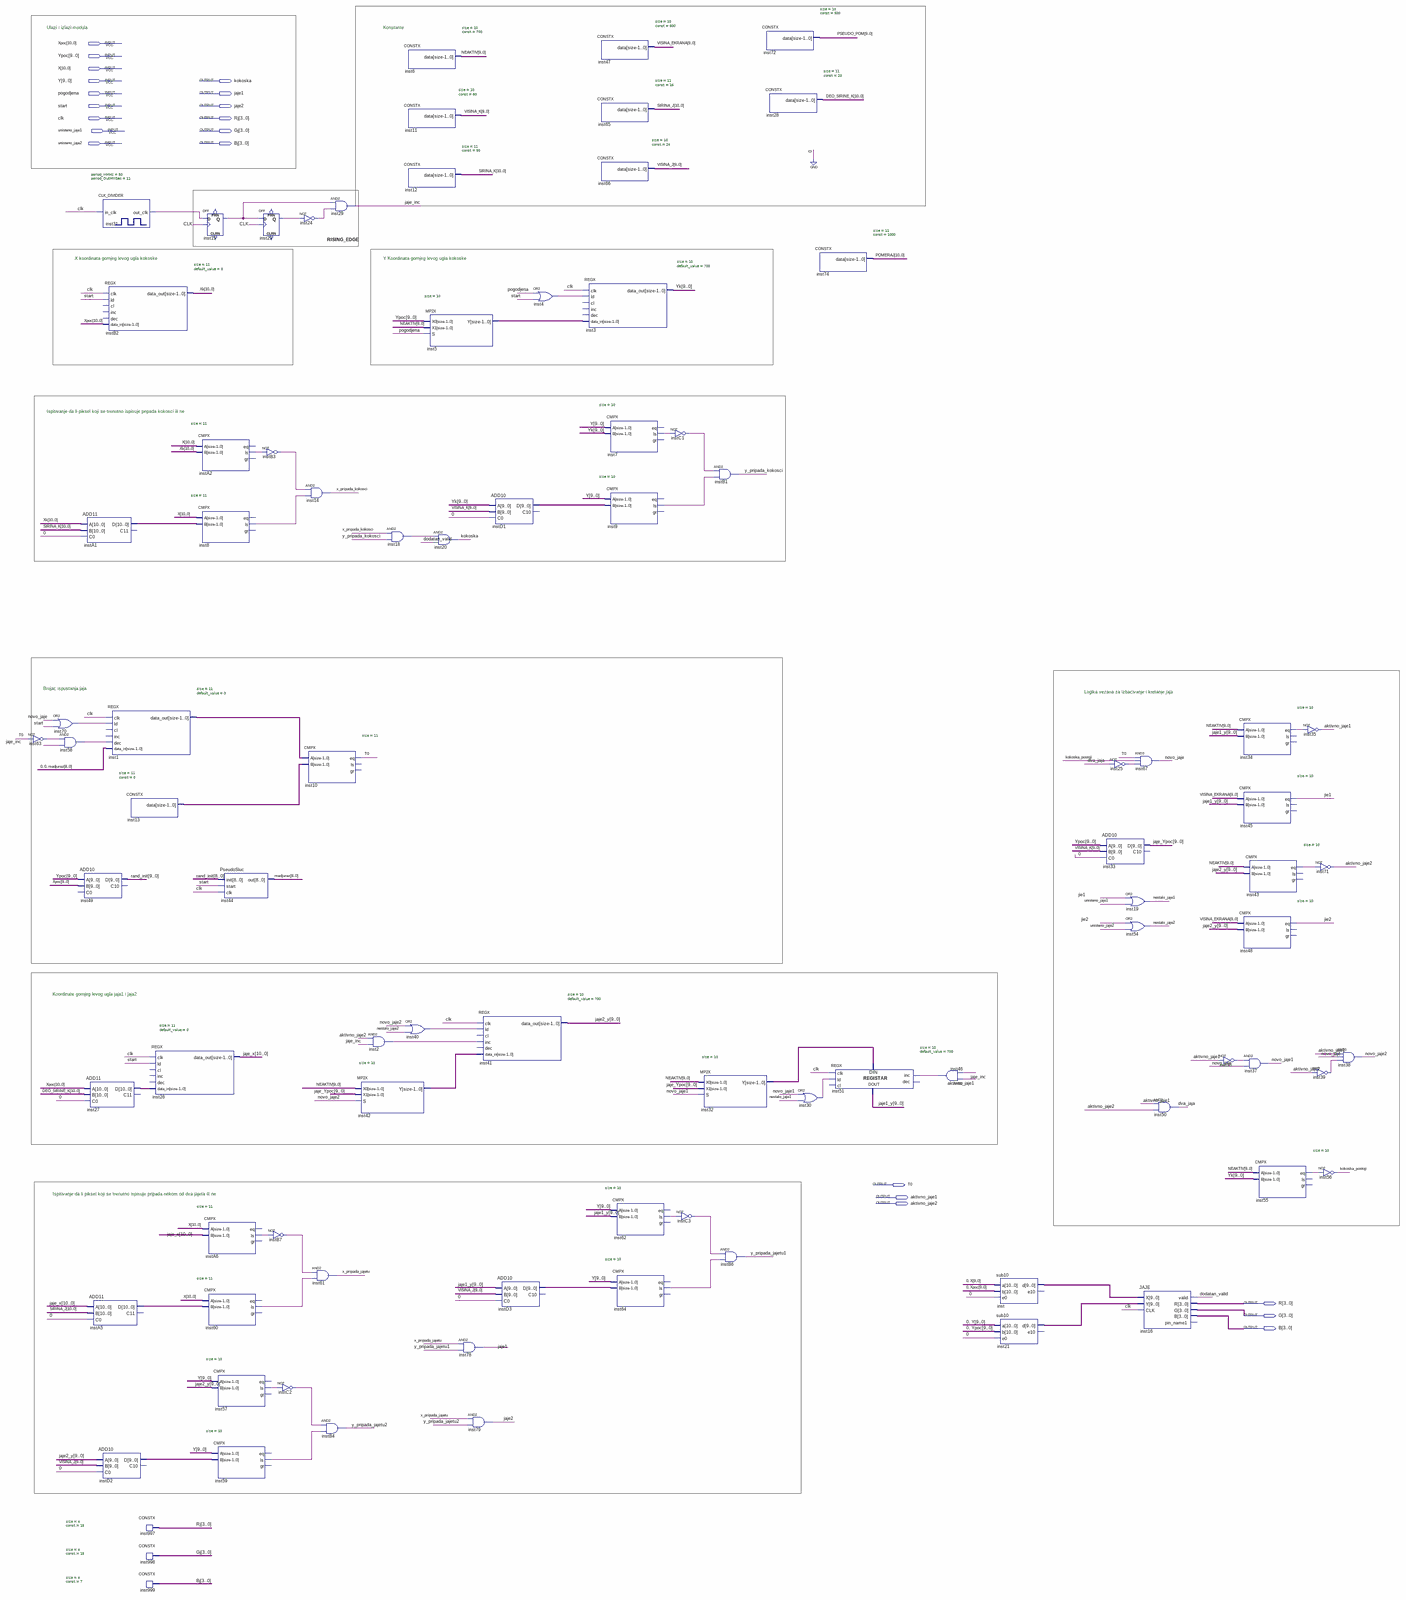
[diagram p0: schematic sheet, whole]
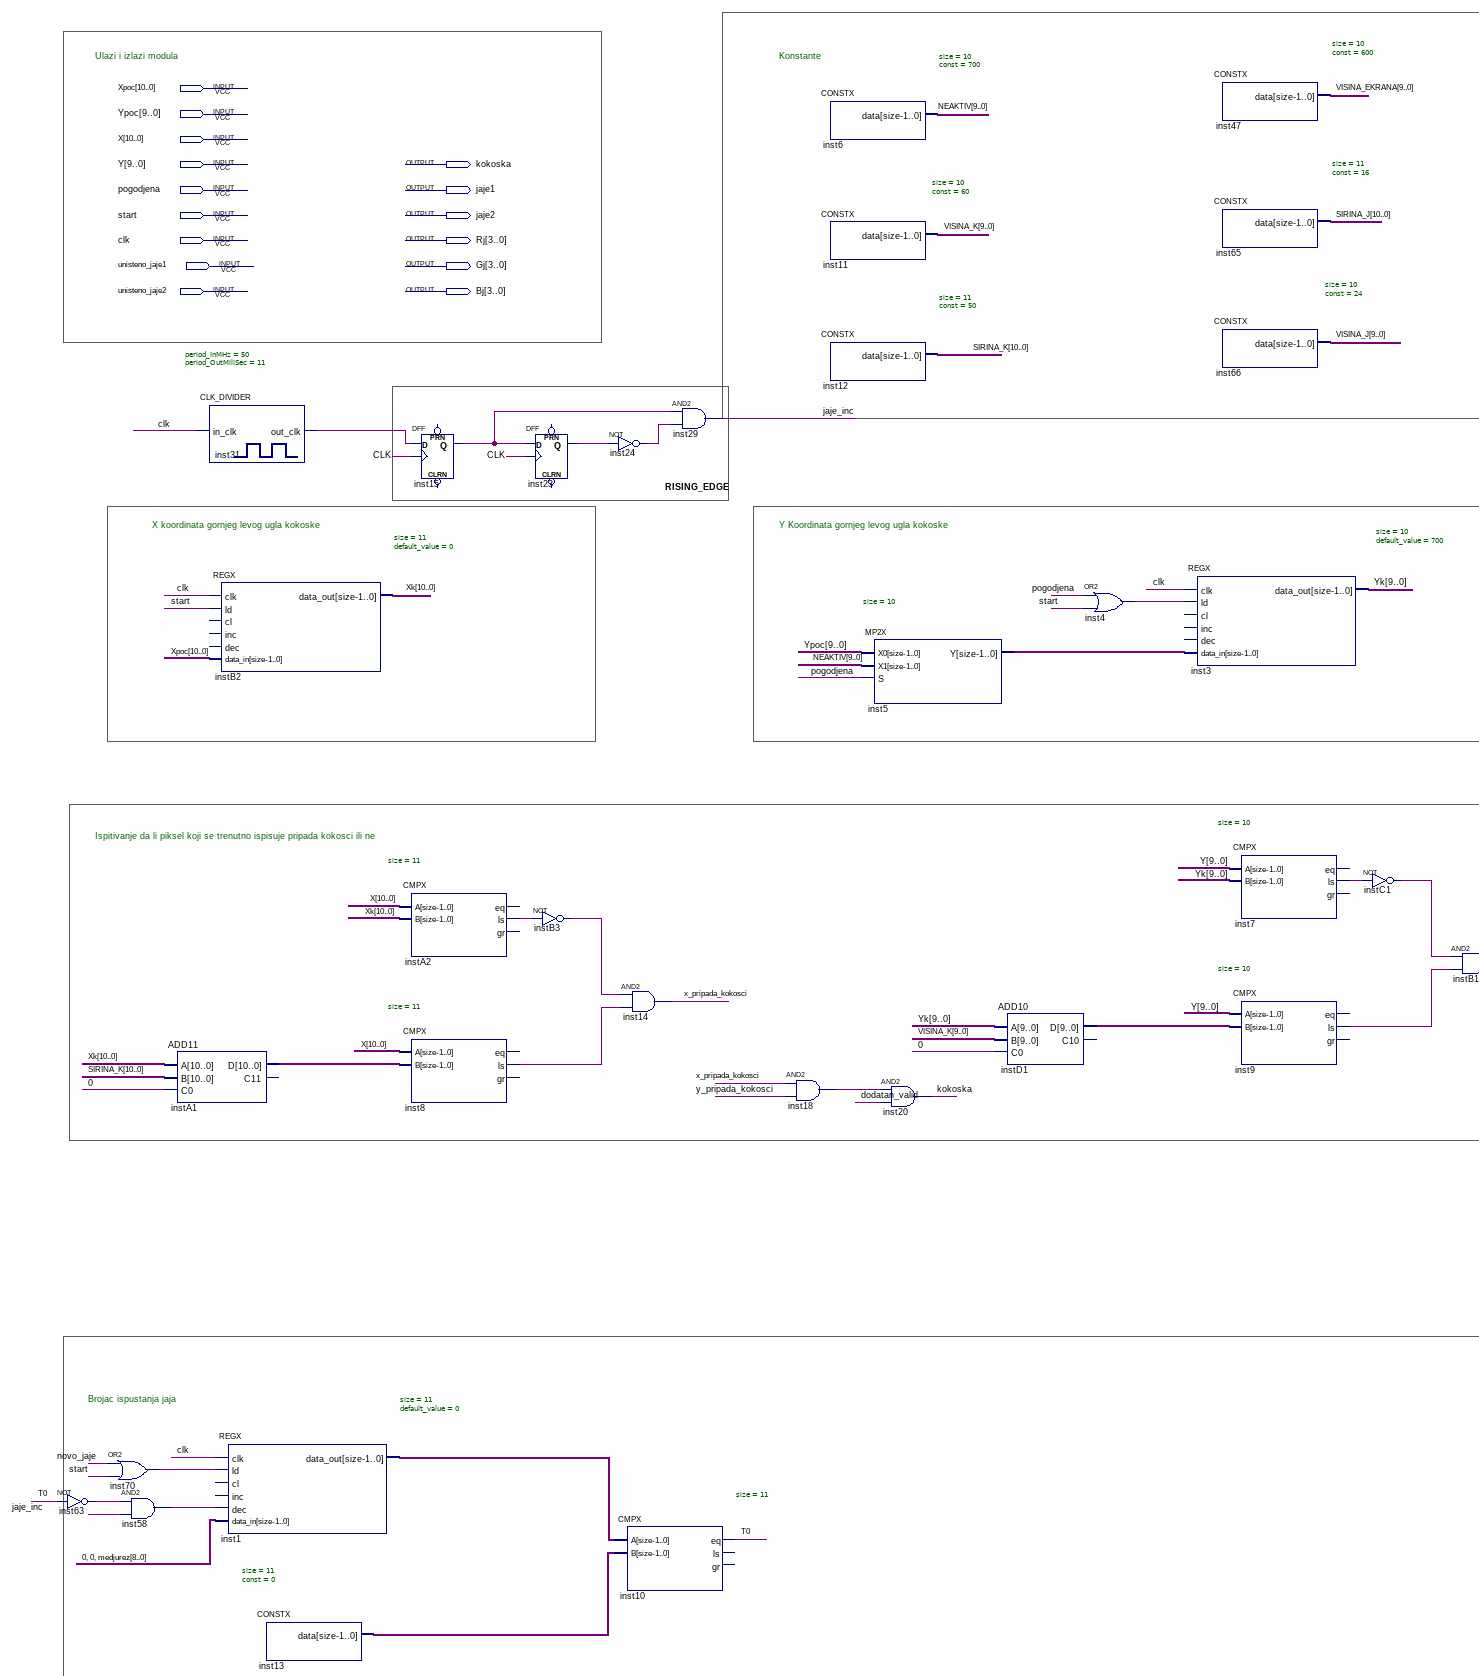
[diagram p1: schematic sheet, upper left part]
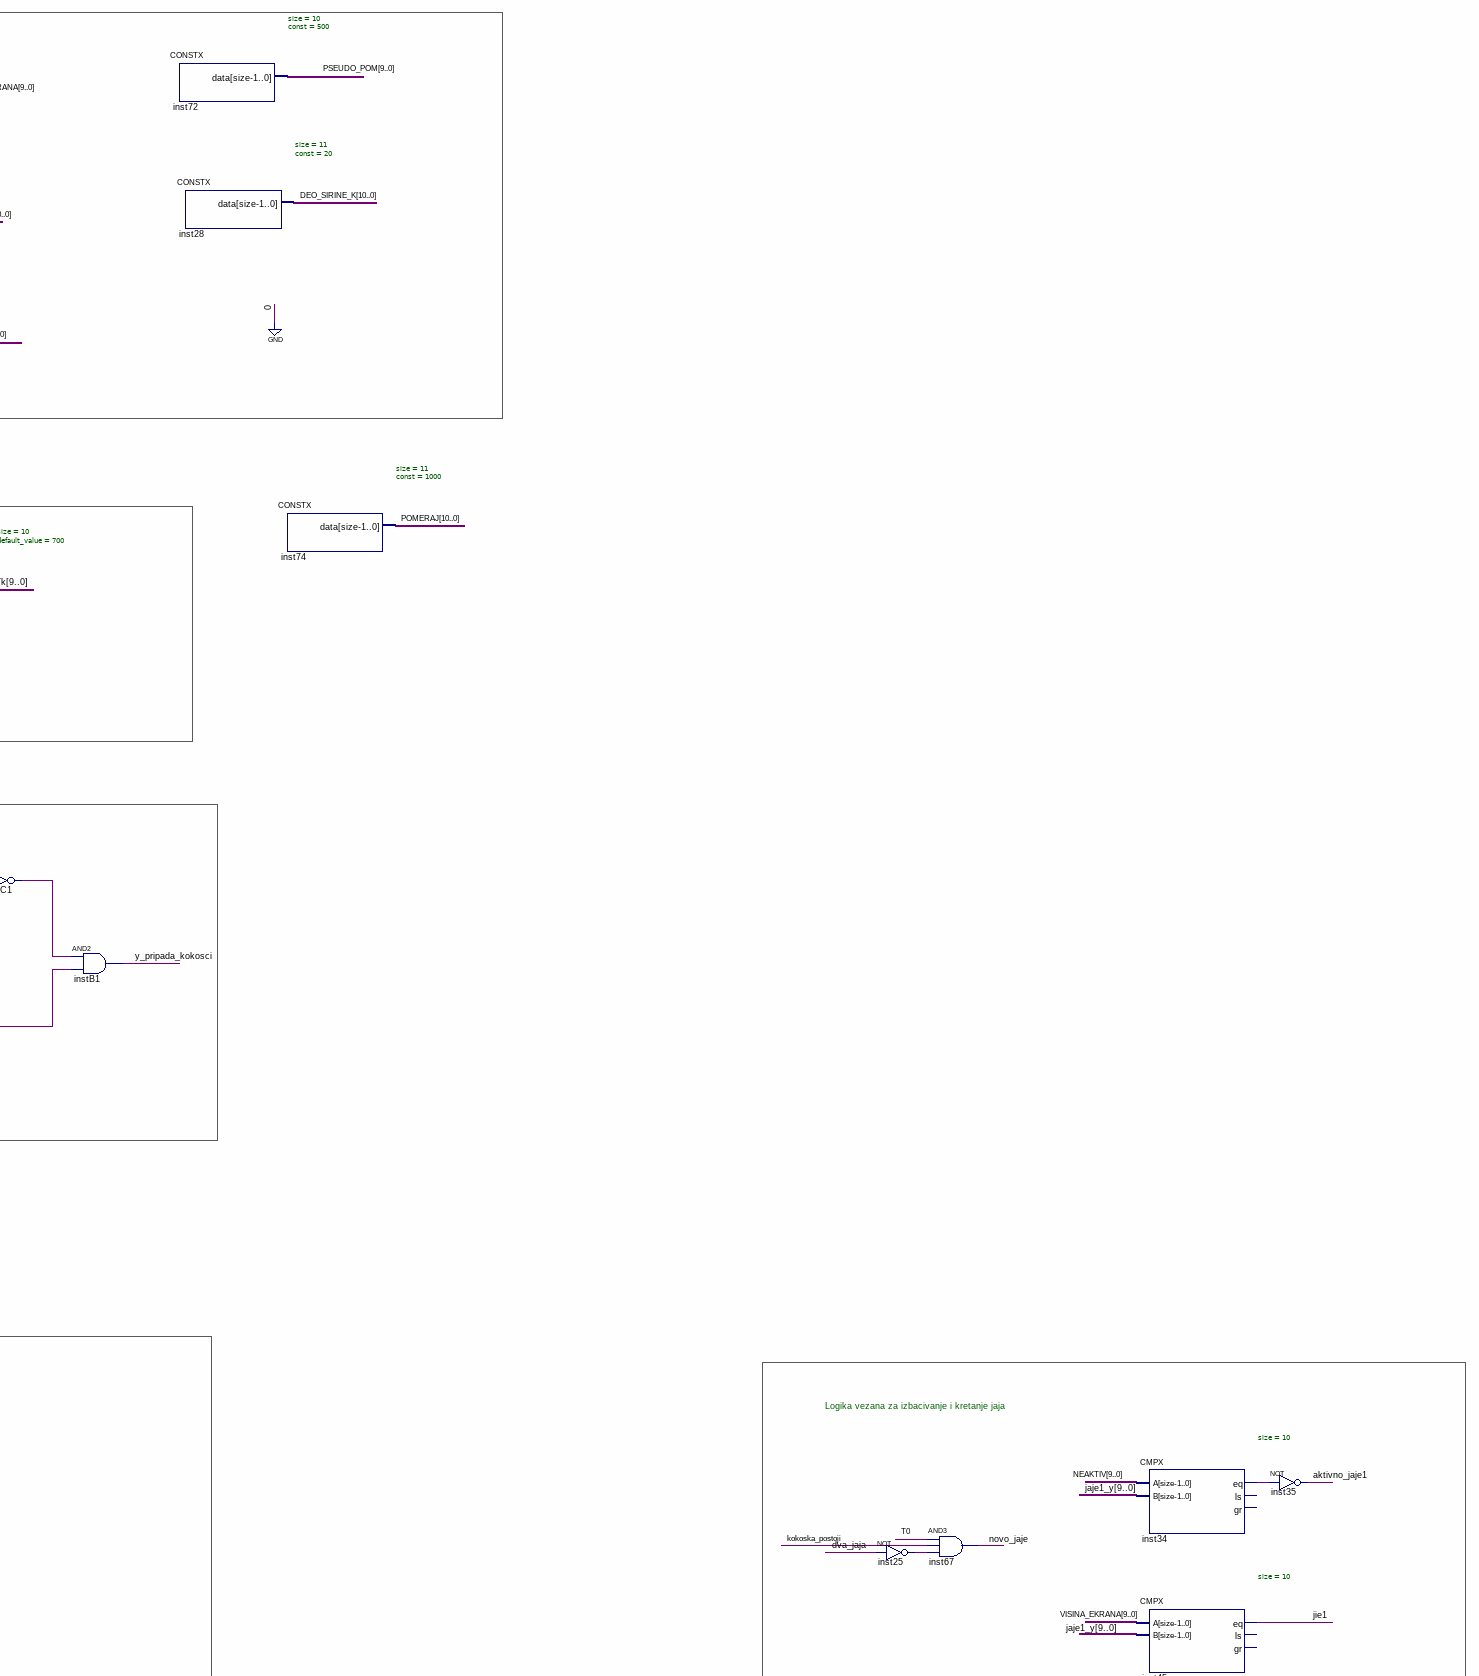
[diagram p2: schematic sheet, upper right part]
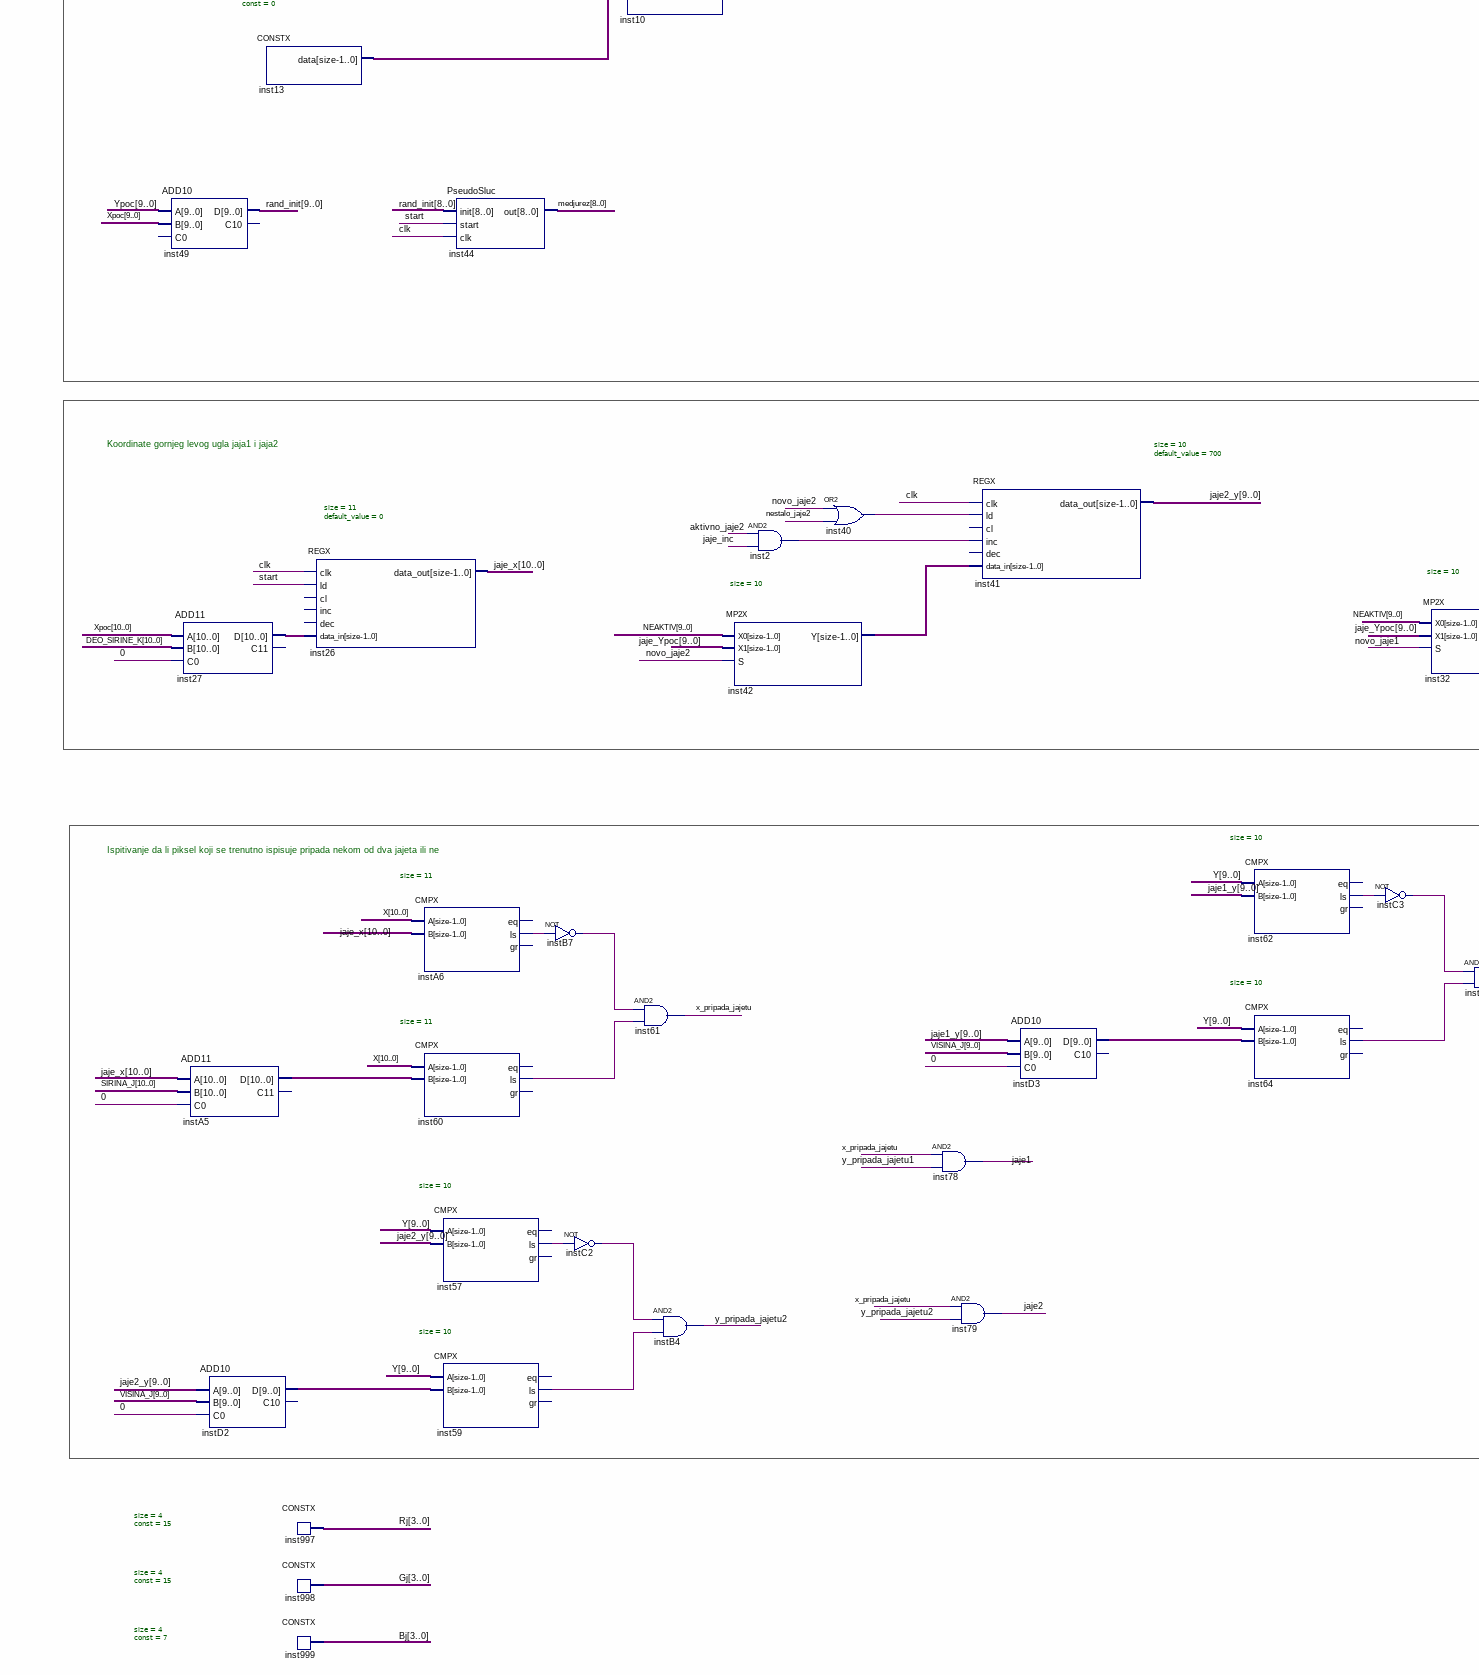
[diagram p3: schematic sheet, lower left part]
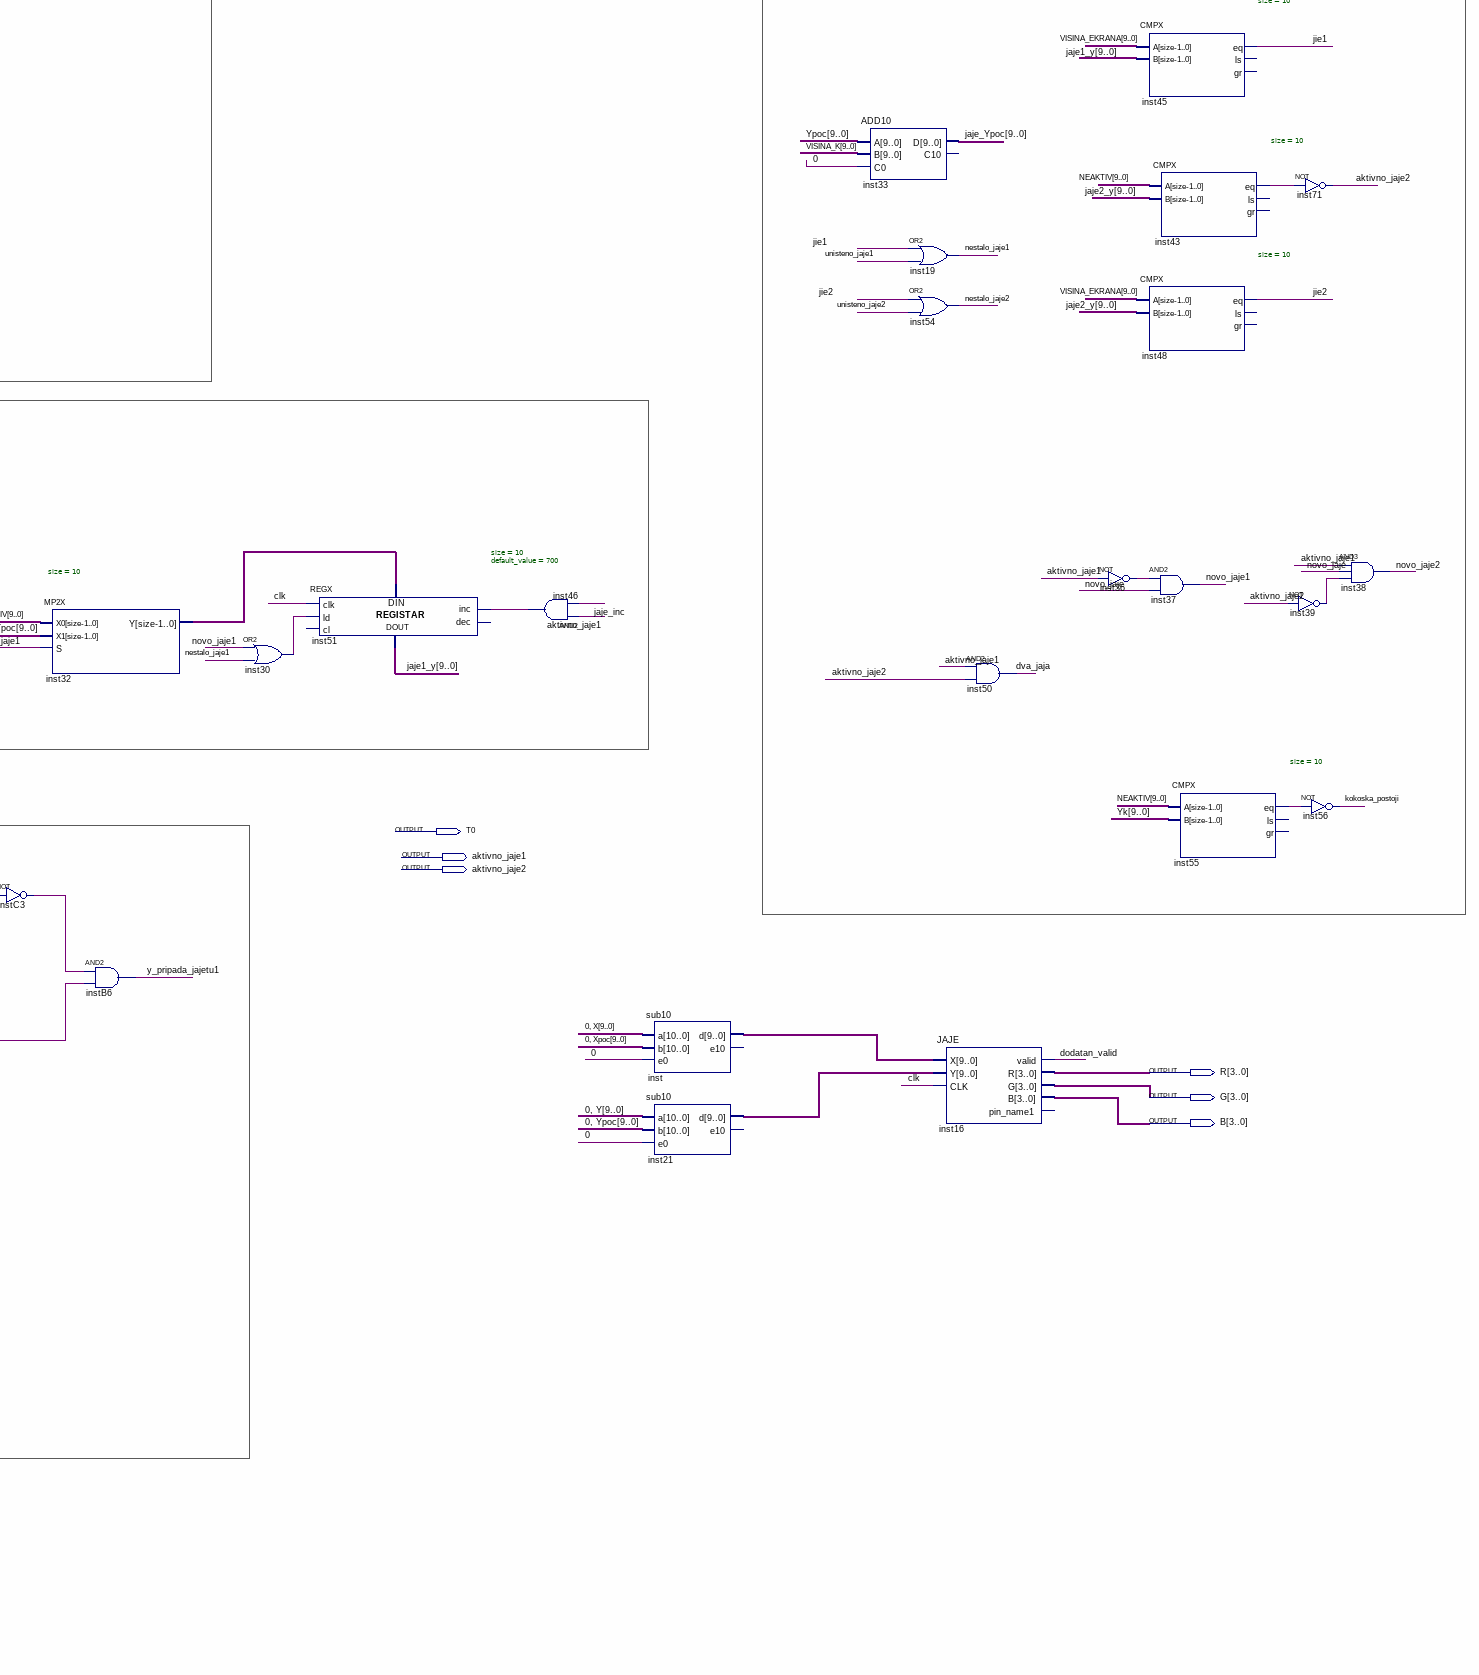
[diagram p4: schematic sheet, lower right part]
// Quartus schematic KokoskaSaJajima.bdf as structural Verilog: 89 symbols, 21 pins
module KokoskaSaJajima (
  input  [10:0] Xpoc,
  input  [9:0] Ypoc,
  input  [10:0] X,
  input  [9:0] Y,
  input  pogodjena,
  input  start,
  input  clk,
  input  unisteno_jaje1,
  input  unisteno_jaje2,
  output kokoska,
  output jaje1,
  output jaje2,
  output [3:0] Rj,
  output [3:0] Gj,
  output [3:0] Bj,
  output T0,
  output aktivno_jaje1,
  output aktivno_jaje2,
  output [3:0] R,
  output [3:0] G,
  output [3:0] B
);

  wire dodatan_valid, dva_jaja, inst2_out, inst4_out, inst7_ls, inst8_ls, inst9_ls, inst15_q, inst18_out,
       inst23_q, inst24_out, inst25_out, inst30_out, inst31_out_clk, inst34_eq, inst36_out, inst39_out,
       inst40_out, inst43_eq, inst46_out, inst55_eq, inst57_ls, inst58_out, inst59_ls, inst60_ls, inst62_ls,
       inst63_out, inst64_ls, inst70_out, instA2_ls, instA6_ls, instB3_out, instB7_out, instC1_out,
       instC2_out, instC3_out, jaje_inc, jie1, jie2, kokoska_postoji, nestalo_jaje1, nestalo_jaje2,
       novo_jaje, novo_jaje1, novo_jaje2, x_pripada_jajetu, x_pripada_kokosci, y_pripada_jajetu1,
       y_pripada_jajetu2, y_pripada_kokosci;
  wire [8:0] medjurez;
  wire [9:0] inst5_y, inst21_d, inst32_y, inst42_y, inst_d, instD1_d, instD2_d, instD3_d, jaje1_y, jaje2_y,
       jaje_Ypoc, NEAKTIV, PSEUDO_POM, rand_init, VISINA_EKRANA, VISINA_J, VISINA_K, Yk;
  wire [10:0] DEO_SIRINE_K, inst1_data_out, inst13_data, inst27_d, instA1_d, instA5_d, jaje_x, POMERAJ,
       SIRINA_J, SIRINA_K, Xk;

  not inst63 (inst63_out, T0);
  or inst70 (inst70_out, novo_jaje, start);
  and inst58 (inst58_out, inst63_out, jaje_inc);
  ADD11 instA1 (.A(Xk), .B(SIRINA_K), .C0(1'b0), .D(instA1_d));  // open: C11
  ADD10 inst49 (.A(Ypoc), .B(Xpoc[9:0]), .D(rand_init));  // open: C0, C10
  ADD11 inst27 (.A(Xpoc), .B(DEO_SIRINE_K), .C0(1'b0), .D(inst27_d));  // open: C11
  CLK_DIVIDER #(.period_InMHz(50), .period_OutMiliSec(11)) inst31 (.in_clk(clk), .out_clk(inst31_out_clk));
  REGX #(.size(11), .default_value(0)) instB2 (
    .clk(clk), .ld(start), .data_in(Xpoc), .data_out(Xk));  // open: cl, inc, dec
  REGX #(.size(11), .default_value(0)) inst1 (
    .clk(clk), .ld(inst70_out), .dec(inst58_out), .data_in({2'b00, medjurez}), .data_out(inst1_data_out));  // open: cl, inc
  ADD11 instA5 (.A(jaje_x), .B(SIRINA_J), .C0(1'b0), .D(instA5_d));  // open: C11
  ADD10 instD2 (.A(jaje2_y), .B(VISINA_J), .C0(1'b0), .D(instD2_d));  // open: C10
  CONSTX #(.size(11), .\const (0)) inst13 (.data(inst13_data));
  REGX #(.size(11), .default_value(0)) inst26 (
    .clk(clk), .ld(start), .data_in(inst27_d), .data_out(jaje_x));  // open: cl, inc, dec
  CONSTX #(.size(4), .\const (15)) inst997 (.data(Rj));
  CONSTX #(.size(4), .\const (15)) inst998 (.data(Gj));
  CONSTX #(.size(4), .\const (7)) inst999 (.data(Bj));
  DFF inst15 (.CLK(clk), .D(inst31_out_clk), .Q(inst15_q));  // open: CLRN, PRN
  CMPX #(.size(11)) instA2 (.A(X), .B(Xk), .ls(instA2_ls));  // open: eq, gr
  CMPX #(.size(11)) inst8 (.A(X), .B(instA1_d), .ls(inst8_ls));  // open: eq, gr
  CMPX #(.size(11)) instA6 (.A(X), .B(jaje_x), .ls(instA6_ls));  // open: eq, gr
  CMPX #(.size(11)) inst60 (.A(X), .B(instA5_d), .ls(inst60_ls));  // open: eq, gr
  PseudoSluc inst44 (.init(rand_init[8:0]), .start(start), .clk(clk), .out(medjurez));
  CMPX #(.size(10)) inst57 (.A(Y), .B(jaje2_y), .ls(inst57_ls));  // open: eq, gr
  CMPX #(.size(10)) inst59 (.A(Y), .B(instD2_d), .ls(inst59_ls));  // open: eq, gr
  DFF inst23 (.CLK(clk), .D(inst15_q), .Q(inst23_q));  // open: CLRN, PRN
  not instB3 (instB3_out, instA2_ls);
  not instB7 (instB7_out, instA6_ls);
  not instC2 (instC2_out, inst57_ls);
  not inst24 (inst24_out, inst23_q);
  and inst14 (x_pripada_kokosci, instB3_out, inst8_ls);
  CMPX #(.size(11)) inst10 (.A(inst1_data_out), .B(inst13_data), .eq(T0));  // open: ls, gr
  and inst29 (jaje_inc, inst15_q, inst24_out);
  and inst61 (x_pripada_jajetu, instB7_out, inst60_ls);
  and instB4 (y_pripada_jajetu2, instC2_out, inst59_ls);
  MP2X #(.size(10)) inst42 (.X0(NEAKTIV), .X1(jaje_Ypoc), .S(novo_jaje2), .Y(inst42_y));
  and inst2 (inst2_out, aktivno_jaje2, jaje_inc);
  CONSTX #(.size(10), .\const (700)) inst6 (.data(NEAKTIV));
  CONSTX #(.size(10), .\const (60)) inst11 (.data(VISINA_K));
  CONSTX #(.size(11), .\const (50)) inst12 (.data(SIRINA_K));
  and inst18 (inst18_out, x_pripada_kokosci, y_pripada_kokosci);
  or inst40 (inst40_out, novo_jaje2, nestalo_jaje2);
  MP2X #(.size(10)) inst5 (.X0(Ypoc), .X1(NEAKTIV), .S(pogodjena), .Y(inst5_y));
  and inst20 (kokoska, inst18_out, dodatan_valid);
  and inst78 (jaje1, x_pripada_jajetu, y_pripada_jajetu1);
  REGX #(.size(10), .default_value(700)) inst41 (
    .clk(clk), .ld(inst40_out), .inc(inst2_out), .data_in(inst42_y), .data_out(jaje2_y));  // open: cl, dec
  and inst79 (jaje2, x_pripada_jajetu, y_pripada_jajetu2);
  ADD10 instD1 (.A(Yk), .B(VISINA_K), .C0(1'b0), .D(instD1_d));  // open: C10
  ADD10 instD3 (.A(jaje1_y), .B(VISINA_J), .C0(1'b0), .D(instD3_d));  // open: C10
  or inst4 (inst4_out, pogodjena, start);
  REGX #(.size(10), .default_value(700)) inst3 (
    .clk(clk), .ld(inst4_out), .data_in(inst5_y), .data_out(Yk));  // open: cl, inc, dec
  CONSTX #(.size(10), .\const (600)) inst47 (.data(VISINA_EKRANA));
  CONSTX #(.size(11), .\const (16)) inst65 (.data(SIRINA_J));
  CONSTX #(.size(10), .\const (24)) inst66 (.data(VISINA_J));
  CMPX #(.size(10)) inst7 (.A(Y), .B(Yk), .ls(inst7_ls));  // open: eq, gr
  CMPX #(.size(10)) inst9 (.A(Y), .B(instD1_d), .ls(inst9_ls));  // open: eq, gr
  CMPX #(.size(10)) inst62 (.A(Y), .B(jaje1_y), .ls(inst62_ls));  // open: eq, gr
  CMPX #(.size(10)) inst64 (.A(Y), .B(instD3_d), .ls(inst64_ls));  // open: eq, gr
  not instC1 (instC1_out, inst7_ls);
  not instC3 (instC3_out, inst62_ls);
  MP2X #(.size(10)) inst32 (.X0(NEAKTIV), .X1(jaje_Ypoc), .S(novo_jaje1), .Y(inst32_y));
  and instB1 (y_pripada_kokosci, instC1_out, inst9_ls);
  and instB6 (y_pripada_jajetu1, instC3_out, inst64_ls);
  CONSTX #(.size(10), .\const (500)) inst72 (.data(PSEUDO_POM));
  CONSTX #(.size(11), .\const (20)) inst28 (.data(DEO_SIRINE_K));
  or inst30 (inst30_out, novo_jaje1, nestalo_jaje1);
  CONSTX #(.size(11), .\const (1000)) inst74 (.data(POMERAJ));
  REGX #(.size(10), .default_value(700)) inst51 (
    .clk(clk), .ld(inst30_out), .inc(inst46_out), .data_in(inst32_y), .data_out(jaje1_y));  // open: cl, dec
  and inst46 (inst46_out, aktivno_jaje1, jaje_inc);
  sub10 inst (.a({1'b0, X[9:0]}), .b({1'b0, Xpoc[9:0]}), .e0(1'b0), .d(inst_d));  // open: e10
  sub10 inst21 (.a({1'b0, Y}), .b({1'b0, Ypoc}), .e0(1'b0), .d(inst21_d));  // open: e10
  ADD10 inst33 (.A(Ypoc), .B(VISINA_K), .C0(1'b0), .D(jaje_Ypoc));  // open: C10
  not inst25 (inst25_out, dva_jaja);
  or inst19 (nestalo_jaje1, jie1, unisteno_jaje1);
  or inst54 (nestalo_jaje2, jie2, unisteno_jaje2);
  and inst67 (novo_jaje, T0, kokoska_postoji, inst25_out);
  and inst50 (dva_jaja, aktivno_jaje1, aktivno_jaje2);
  JAJE inst16 (.X(inst_d), .Y(inst21_d), .CLK(clk), .valid(dodatan_valid), .R(R), .G(G), .B(B));  // open: pin_name1
  not inst36 (inst36_out, aktivno_jaje1);
  CMPX #(.size(10)) inst34 (.A(NEAKTIV), .B(jaje1_y), .eq(inst34_eq));  // open: ls, gr
  CMPX #(.size(10)) inst45 (.A(VISINA_EKRANA), .B(jaje1_y), .eq(jie1));  // open: ls, gr
  CMPX #(.size(10)) inst43 (.A(NEAKTIV), .B(jaje2_y), .eq(inst43_eq));  // open: ls, gr
  CMPX #(.size(10)) inst48 (.A(VISINA_EKRANA), .B(jaje2_y), .eq(jie2));  // open: ls, gr
  and inst37 (novo_jaje1, inst36_out, novo_jaje);
  CMPX #(.size(10)) inst55 (.A(NEAKTIV), .B(Yk), .eq(inst55_eq));  // open: ls, gr
  not inst35 (aktivno_jaje1, inst34_eq);
  not inst71 (aktivno_jaje2, inst43_eq);
  not inst39 (inst39_out, aktivno_jaje2);
  not inst56 (kokoska_postoji, inst55_eq);
  and inst38 (novo_jaje2, aktivno_jaje1, novo_jaje, inst39_out);

  // Notes on the sheet:
  //   Ulazi i izlazi modula    
  //   Konstante
  //   RISING_EDGE
  //   X koordinata gornjeg levog ugla kokoske 
  //   Y Koordinata gornjeg levog ugla kokoske 
  //   Ispitivanje da li piksel koji se trenutno ispisuje pripada kokosci ili ne     
  //   Brojac ispustanja jaja       
  //   Logika vezana za izbacivanje i kretanje jaja    
  //   Koordinate gornjeg levog ugla jaja1 i jaja2        
  //   Ispitivanje da li piksel koji se trenutno ispisuje pripada nekom od dva jajeta ili ne     
endmodule
